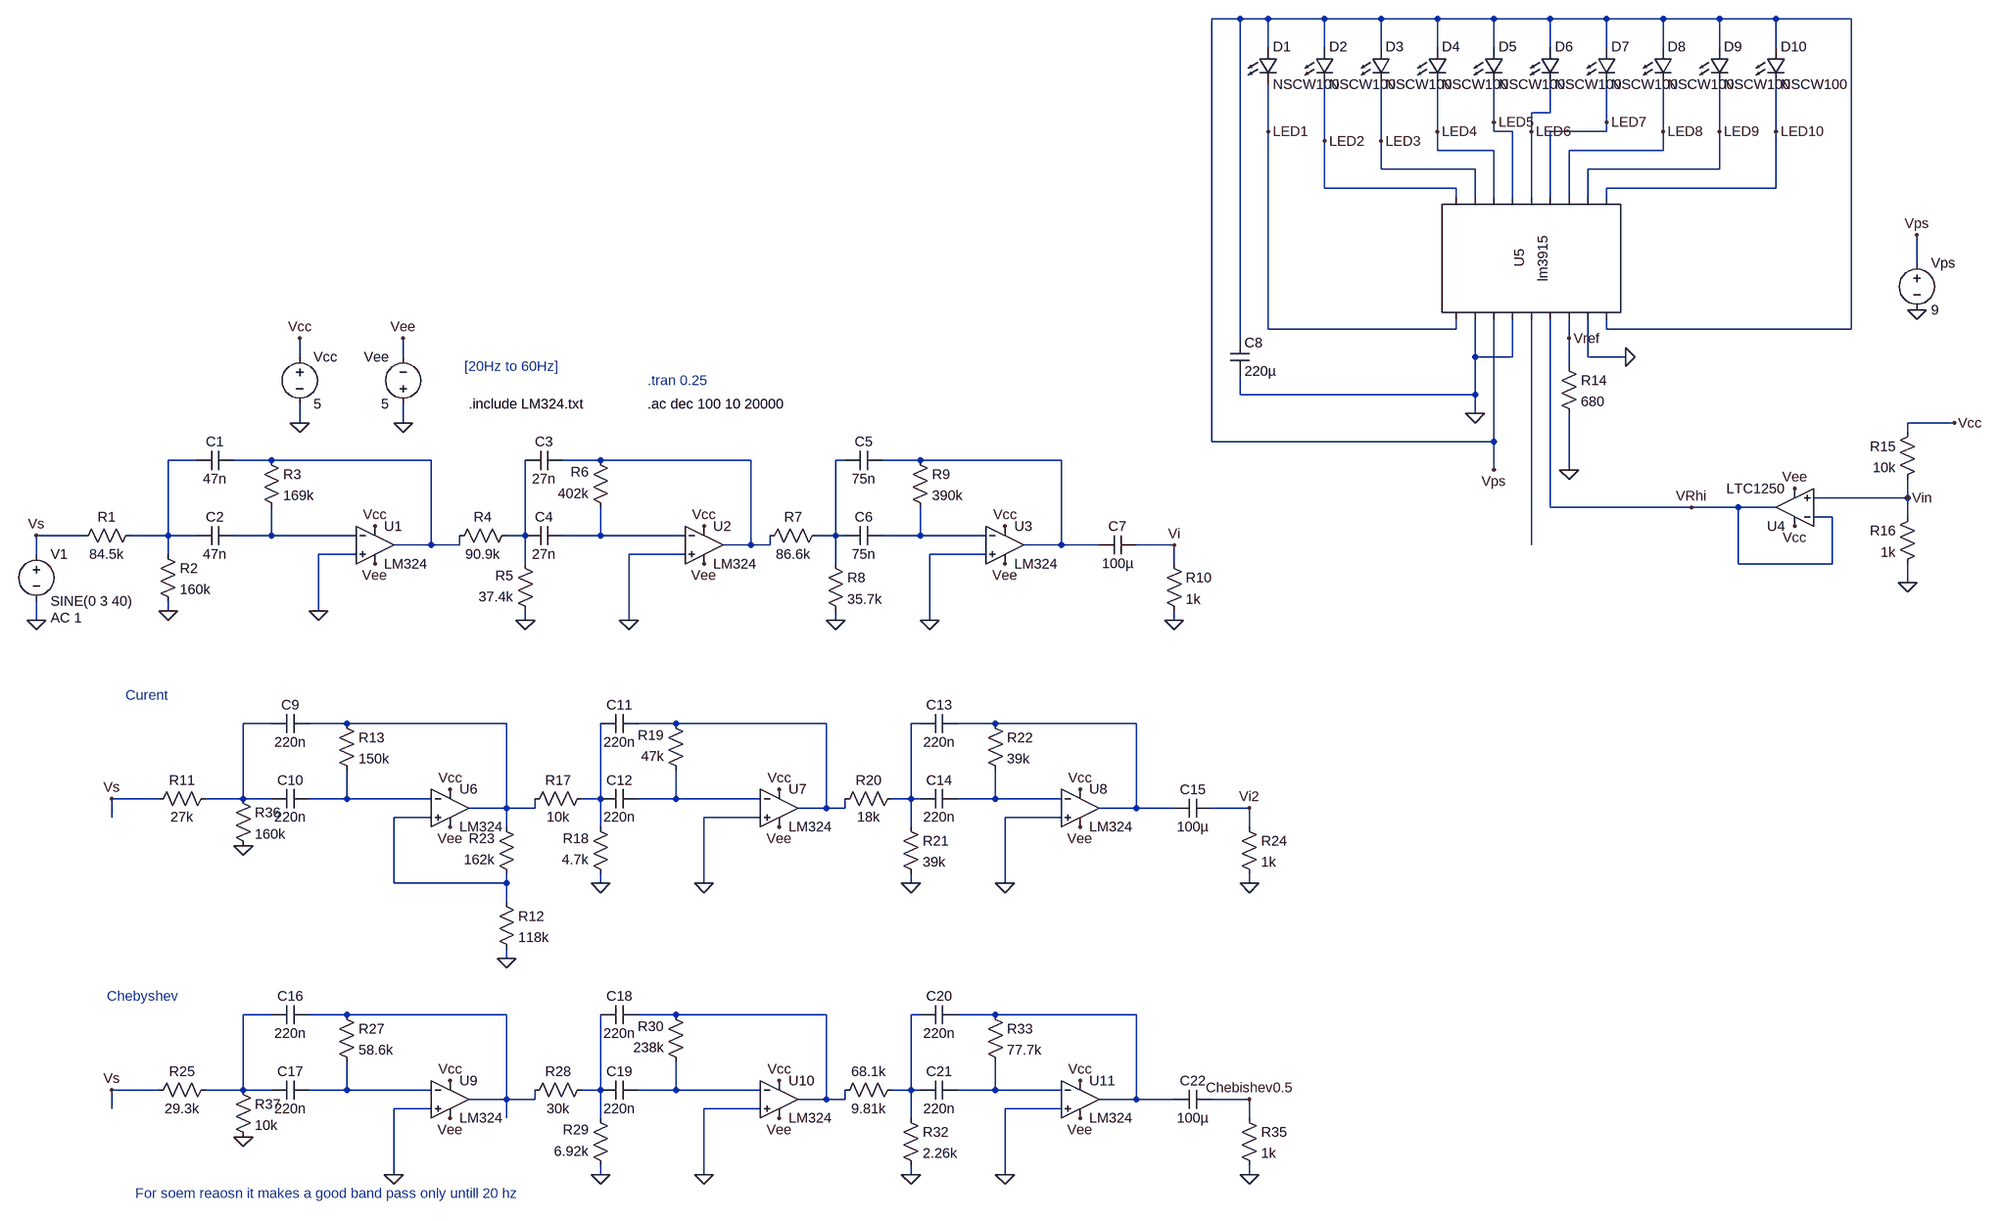
[diagram p0: schematic FinalSubBassFilterWithLEDDriver.asc]
FinalSubBassFilterWithLEDDriver.asc, the LTspice schematic file:
Version 4.1
SHEET 1 5108 1364
WIRE 1568 -736 1520 -736
WIRE 1616 -736 1568 -736
WIRE 1712 -736 1616 -736
WIRE 1808 -736 1712 -736
WIRE 1904 -736 1808 -736
WIRE 2000 -736 1904 -736
WIRE 2096 -736 2000 -736
WIRE 2192 -736 2096 -736
WIRE 2288 -736 2192 -736
WIRE 2384 -736 2288 -736
WIRE 2480 -736 2384 -736
WIRE 2608 -736 2480 -736
WIRE 1616 -688 1616 -736
WIRE 1712 -688 1712 -736
WIRE 1808 -688 1808 -736
WIRE 1904 -688 1904 -736
WIRE 2000 -688 2000 -736
WIRE 2096 -688 2096 -736
WIRE 2192 -688 2192 -736
WIRE 2288 -688 2288 -736
WIRE 2384 -688 2384 -736
WIRE 2480 -688 2480 -736
WIRE 2096 -576 2096 -624
WIRE 2096 -576 2064 -576
WIRE 2000 -560 2000 -624
WIRE 2192 -560 2192 -624
WIRE 1616 -544 1616 -624
WIRE 1904 -544 1904 -624
WIRE 2000 -544 2000 -560
WIRE 2032 -544 2000 -544
WIRE 2064 -544 2064 -576
WIRE 2192 -544 2192 -560
WIRE 2192 -544 2096 -544
WIRE 2288 -544 2288 -624
WIRE 2384 -544 2384 -624
WIRE 2480 -544 2480 -624
WIRE 1712 -528 1712 -624
WIRE 1808 -528 1808 -624
WIRE 1904 -512 1904 -544
WIRE 2000 -512 1904 -512
WIRE 2288 -512 2288 -544
WIRE 2288 -512 2128 -512
WIRE 1808 -480 1808 -528
WIRE 1968 -480 1808 -480
WIRE 2384 -480 2384 -544
WIRE 2384 -480 2160 -480
WIRE 1712 -448 1712 -528
WIRE 1936 -448 1712 -448
WIRE 2480 -448 2480 -544
WIRE 2480 -448 2192 -448
WIRE 1936 -432 1936 -448
WIRE 1968 -432 1968 -480
WIRE 2000 -432 2000 -512
WIRE 2032 -432 2032 -544
WIRE 2064 -432 2064 -544
WIRE 2096 -432 2096 -544
WIRE 2128 -432 2128 -512
WIRE 2160 -432 2160 -480
WIRE 2192 -432 2192 -448
WIRE 2720 -320 2720 -368
WIRE 1616 -208 1616 -544
WIRE 1936 -208 1936 -224
WIRE 1936 -208 1616 -208
WIRE 2192 -208 2192 -224
WIRE 2608 -208 2608 -736
WIRE 2608 -208 2192 -208
WIRE 1568 -192 1568 -736
WIRE 2128 -192 2128 -224
WIRE -32 -160 -32 -192
WIRE 144 -160 144 -192
WIRE 1968 -160 1968 -224
WIRE 2032 -160 2032 -224
WIRE 2032 -160 1968 -160
WIRE 2160 -160 2160 -224
WIRE 2224 -160 2160 -160
WIRE 2128 -144 2128 -192
WIRE 1568 -96 1568 -128
WIRE 1968 -96 1968 -160
WIRE 1968 -96 1568 -96
WIRE 1968 -64 1968 -96
WIRE -32 -48 -32 -80
WIRE 144 -48 144 -80
WIRE 2784 -48 2704 -48
WIRE 2704 -32 2704 -48
WIRE 1520 -16 1520 -736
WIRE 2000 -16 2000 -224
WIRE 2000 -16 1520 -16
WIRE -208 16 -256 16
WIRE -80 16 -144 16
WIRE 192 16 -80 16
WIRE 480 16 416 16
WIRE 736 16 480 16
WIRE 896 16 880 16
WIRE 1024 16 960 16
WIRE 1264 16 1024 16
WIRE 2000 32 2000 -16
WIRE 2128 32 2128 -64
WIRE 2704 80 2704 48
WIRE 2704 80 2544 80
WIRE 2096 96 2096 -224
WIRE 2336 96 2096 96
WIRE 2416 96 2336 96
WIRE 2480 96 2416 96
WIRE 2576 112 2544 112
WIRE 2704 112 2704 80
WIRE -400 144 -480 144
WIRE -256 144 -256 16
WIRE -256 144 -320 144
WIRE -208 144 -256 144
WIRE -80 144 -80 96
WIRE -80 144 -144 144
WIRE 64 144 -80 144
WIRE 352 144 352 16
WIRE 352 144 320 144
WIRE 480 144 480 96
WIRE 480 144 416 144
WIRE 624 144 480 144
WIRE 880 144 880 16
WIRE 880 144 848 144
WIRE 896 144 880 144
WIRE 1024 144 1024 96
WIRE 1024 144 960 144
WIRE 1136 144 1024 144
WIRE 192 160 192 16
WIRE 192 160 128 160
WIRE 240 160 240 144
WIRE 240 160 192 160
WIRE 736 160 736 16
WIRE 736 160 688 160
WIRE 768 160 768 144
WIRE 768 160 736 160
WIRE 1264 160 1264 16
WIRE 1264 160 1200 160
WIRE 1328 160 1264 160
WIRE 1456 160 1392 160
WIRE 2064 160 2064 -224
WIRE -480 176 -480 144
WIRE -256 176 -256 144
WIRE 64 176 0 176
WIRE 624 176 528 176
WIRE 1136 176 1040 176
WIRE 352 192 352 144
WIRE 880 192 880 144
WIRE 1456 192 1456 160
WIRE 2416 192 2416 96
WIRE 2576 192 2576 112
WIRE 2576 192 2416 192
WIRE 2704 224 2704 192
WIRE -256 272 -256 256
WIRE 0 272 0 176
WIRE -480 288 -480 256
WIRE 352 288 352 272
WIRE 528 288 528 176
WIRE 880 288 880 272
WIRE 1040 288 1040 176
WIRE 1456 288 1456 272
WIRE -80 464 -128 464
WIRE 48 464 -16 464
WIRE 320 464 48 464
WIRE 608 464 544 464
WIRE 864 464 608 464
WIRE 1024 464 1008 464
WIRE 1152 464 1088 464
WIRE 1392 464 1152 464
WIRE -272 592 -352 592
WIRE -128 592 -128 464
WIRE -128 592 -192 592
WIRE -80 592 -128 592
WIRE 48 592 48 544
WIRE 48 592 -16 592
WIRE 192 592 48 592
WIRE 480 592 480 464
WIRE 480 592 448 592
WIRE 608 592 608 544
WIRE 608 592 544 592
WIRE 752 592 608 592
WIRE 1008 592 1008 464
WIRE 1008 592 976 592
WIRE 1024 592 1008 592
WIRE 1152 592 1152 544
WIRE 1152 592 1088 592
WIRE 1264 592 1152 592
WIRE 320 608 320 464
WIRE 320 608 256 608
WIRE 368 608 368 592
WIRE 368 608 320 608
WIRE 864 608 864 464
WIRE 864 608 816 608
WIRE 896 608 896 592
WIRE 896 608 864 608
WIRE 1392 608 1392 464
WIRE 1392 608 1328 608
WIRE 1456 608 1392 608
WIRE 1584 608 1520 608
WIRE -352 624 -352 592
WIRE 192 624 128 624
WIRE 752 624 656 624
WIRE 1264 624 1168 624
WIRE 320 640 320 608
WIRE 480 640 480 592
WIRE 1008 640 1008 592
WIRE 1584 640 1584 608
WIRE 128 736 128 624
WIRE 320 736 320 720
WIRE 320 736 128 736
WIRE 480 736 480 720
WIRE 656 736 656 624
WIRE 1008 736 1008 720
WIRE 1168 736 1168 624
WIRE 1584 736 1584 720
WIRE 320 768 320 736
WIRE 320 864 320 848
WIRE -80 960 -128 960
WIRE 48 960 -16 960
WIRE 320 960 48 960
WIRE 608 960 544 960
WIRE 864 960 608 960
WIRE 1024 960 1008 960
WIRE 1152 960 1088 960
WIRE 1392 960 1152 960
WIRE -272 1088 -352 1088
WIRE -128 1088 -128 960
WIRE -128 1088 -192 1088
WIRE -80 1088 -128 1088
WIRE 48 1088 48 1040
WIRE 48 1088 -16 1088
WIRE 192 1088 48 1088
WIRE 480 1088 480 960
WIRE 480 1088 448 1088
WIRE 608 1088 608 1040
WIRE 608 1088 544 1088
WIRE 752 1088 608 1088
WIRE 1008 1088 1008 960
WIRE 1008 1088 976 1088
WIRE 1024 1088 1008 1088
WIRE 1152 1088 1152 1040
WIRE 1152 1088 1088 1088
WIRE 1264 1088 1152 1088
WIRE 320 1104 320 960
WIRE 320 1104 256 1104
WIRE 368 1104 368 1088
WIRE 368 1104 320 1104
WIRE 864 1104 864 960
WIRE 864 1104 816 1104
WIRE 896 1104 896 1088
WIRE 896 1104 864 1104
WIRE 1392 1104 1392 960
WIRE 1392 1104 1328 1104
WIRE 1456 1104 1392 1104
WIRE 1584 1104 1520 1104
WIRE -352 1120 -352 1088
WIRE 192 1120 128 1120
WIRE 752 1120 656 1120
WIRE 1264 1120 1168 1120
WIRE 320 1136 320 1104
WIRE 480 1136 480 1088
WIRE 1008 1136 1008 1088
WIRE 1584 1136 1584 1104
WIRE 128 1232 128 1120
WIRE 480 1232 480 1216
WIRE 656 1232 656 1120
WIRE 1008 1232 1008 1216
WIRE 1168 1232 1168 1120
WIRE 1584 1232 1584 1216
FLAG 528 288 0
FLAG -480 288 0
FLAG -480 144 Vs
FLAG 1040 288 0
FLAG 880 288 0
FLAG 352 288 0
FLAG -256 272 0
FLAG 0 272 0
FLAG 96 192 Vee
FLAG 96 128 Vcc
FLAG 656 192 Vee
FLAG 656 128 Vcc
FLAG 1168 192 Vee
FLAG 1168 128 Vcc
FLAG -32 -192 Vcc
FLAG -32 -48 0
FLAG 144 -48 0
FLAG 144 -192 Vee
FLAG 1456 288 0
FLAG 1456 160 Vi
FLAG 1968 -64 0
FLAG 2720 -240 0
FLAG 2720 -368 Vps
FLAG 2128 32 0
FLAG 2000 32 Vps
FLAG 1616 -544 LED1
FLAG 1712 -528 LED2
FLAG 1808 -528 LED3
FLAG 1904 -544 LED4
FLAG 2000 -560 LED5
FLAG 2064 -544 LED6
FLAG 2192 -560 LED7
FLAG 2288 -544 LED8
FLAG 2384 -544 LED9
FLAG 2480 -544 LED10
FLAG 2224 -160 0
FLAG 2128 -192 Vref
FLAG 2704 224 0
FLAG 2512 128 Vcc
FLAG 2704 80 Vin
FLAG 2336 96 VRhi
FLAG 2512 64 Vee
FLAG 2784 -48 Vcc
FLAG 656 736 0
FLAG -352 592 Vs
FLAG 1168 736 0
FLAG 1008 736 0
FLAG 480 736 0
FLAG 320 864 0
FLAG 224 640 Vee
FLAG 224 576 Vcc
FLAG 784 640 Vee
FLAG 784 576 Vcc
FLAG 1296 640 Vee
FLAG 1296 576 Vcc
FLAG 1584 608 Vi2
FLAG 1584 736 0
FLAG 656 1232 0
FLAG -352 1088 Vs
FLAG 1168 1232 0
FLAG 1008 1232 0
FLAG 480 1232 0
FLAG 224 1136 Vee
FLAG 224 1072 Vcc
FLAG 784 1136 Vee
FLAG 784 1072 Vcc
FLAG 1296 1136 Vee
FLAG 1296 1072 Vcc
FLAG 1584 1104 Chebishev0.5
FLAG 1584 1232 0
FLAG 128 1232 0
FLAG -128 672 0
FLAG -128 1168 0
SYMBOL res -304 128 R90
WINDOW 0 0 56 VBottom 2
WINDOW 3 32 56 VTop 2
SYMATTR InstName R1
SYMATTR Value 84.5k
SYMBOL voltage -480 160 R0
WINDOW 123 24 124 Left 2
WINDOW 39 0 0 Left 0
SYMATTR Value2 AC 1
SYMATTR InstName V1
SYMATTR Value SINE(0 3 40)
SYMBOL res -272 160 R0
SYMATTR InstName R2
SYMATTR Value 160k
SYMBOL res -96 0 R0
SYMATTR InstName R3
SYMATTR Value 169k
SYMBOL res 336 128 R90
WINDOW 0 0 56 VBottom 2
WINDOW 3 32 56 VTop 2
SYMATTR InstName R4
SYMATTR Value 90.9k
SYMBOL res 368 288 R180
WINDOW 0 36 76 Left 2
WINDOW 3 36 40 Left 2
SYMATTR InstName R5
SYMATTR Value 37.4k
SYMBOL res 496 112 R180
WINDOW 0 36 76 Left 2
WINDOW 3 36 40 Left 2
SYMATTR InstName R6
SYMATTR Value 402k
SYMBOL res 752 160 R270
WINDOW 0 32 56 VTop 2
WINDOW 3 0 56 VBottom 2
SYMATTR InstName R7
SYMATTR Value 86.6k
SYMBOL res 864 176 R0
SYMATTR InstName R8
SYMATTR Value 35.7k
SYMBOL res 1008 0 R0
SYMATTR InstName R9
SYMATTR Value 390k
SYMBOL cap -144 0 R90
WINDOW 0 0 32 VBottom 2
WINDOW 3 32 32 VTop 2
SYMATTR InstName C1
SYMATTR Value 47n
SYMBOL cap -144 128 R90
WINDOW 0 0 32 VBottom 2
WINDOW 3 32 32 VTop 2
SYMATTR InstName C2
SYMATTR Value 47n
SYMBOL cap 416 0 R90
WINDOW 0 0 32 VBottom 2
WINDOW 3 32 32 VTop 2
SYMATTR InstName C3
SYMATTR Value 27n
SYMBOL cap 416 128 R90
WINDOW 0 0 32 VBottom 2
WINDOW 3 32 32 VTop 2
SYMATTR InstName C4
SYMATTR Value 27n
SYMBOL cap 960 0 R90
WINDOW 0 0 32 VBottom 2
WINDOW 3 32 32 VTop 2
SYMATTR InstName C5
SYMATTR Value 75n
SYMBOL cap 960 128 R90
WINDOW 0 0 32 VBottom 2
WINDOW 3 32 32 VTop 2
SYMATTR InstName C6
SYMATTR Value 75n
SYMBOL OpAmps\\opamp2 96 96 R0
SYMATTR InstName U1
SYMATTR Value LM324
SYMBOL OpAmps\\opamp2 656 96 R0
SYMATTR InstName U2
SYMATTR Value LM324
SYMBOL OpAmps\\opamp2 1168 96 R0
SYMATTR InstName U3
SYMATTR Value LM324
SYMBOL voltage -32 -176 R0
WINDOW 123 0 0 Left 0
WINDOW 39 0 0 Left 0
SYMATTR InstName Vcc
SYMATTR Value 5
SYMBOL voltage 144 -64 R180
WINDOW 0 24 96 Left 2
WINDOW 3 24 16 Left 2
WINDOW 123 0 0 Left 0
WINDOW 39 0 0 Left 0
SYMATTR InstName Vee
SYMATTR Value 5
SYMBOL cap 1392 144 R90
WINDOW 0 0 32 VBottom 2
WINDOW 3 32 32 VTop 2
SYMATTR InstName C7
SYMATTR Value 100µ
SYMBOL res 1440 176 R0
SYMATTR InstName R10
SYMATTR Value 1k
SYMBOL LED 1600 -688 R0
SYMATTR InstName D1
SYMATTR Value NSCW100
SYMBOL LED 1696 -688 R0
SYMATTR InstName D2
SYMATTR Value NSCW100
SYMBOL LED 1792 -688 R0
SYMATTR InstName D3
SYMATTR Value NSCW100
SYMBOL LED 1888 -688 R0
SYMATTR InstName D4
SYMATTR Value NSCW100
SYMBOL LED 1984 -688 R0
SYMATTR InstName D5
SYMATTR Value NSCW100
SYMBOL LED 2080 -688 R0
SYMATTR InstName D6
SYMATTR Value NSCW100
SYMBOL LED 2176 -688 R0
SYMATTR InstName D7
SYMATTR Value NSCW100
SYMBOL LED 2272 -688 R0
SYMATTR InstName D8
SYMATTR Value NSCW100
SYMBOL LED 2368 -688 R0
SYMATTR InstName D9
SYMATTR Value NSCW100
SYMBOL LED 2464 -688 R0
SYMATTR InstName D10
SYMATTR Value NSCW100
SYMBOL cap 1552 -192 R0
SYMATTR InstName C8
SYMATTR Value 220µ
SYMBOL voltage 2720 -336 R0
WINDOW 123 0 0 Left 0
WINDOW 39 0 0 Left 0
SYMATTR InstName Vps
SYMATTR Value 9
SYMBOL AutoGenerated\\lm3915 2064 -320 R270
SYMATTR InstName U5
SYMBOL res 2112 -160 R0
SYMATTR InstName R14
SYMATTR Value 680
SYMBOL res 2720 -48 M0
SYMATTR InstName R15
SYMATTR Value 10k
SYMBOL res 2720 96 M0
SYMATTR InstName R16
SYMATTR Value 1k
SYMBOL OpAmps\\LTC1250 2512 160 R180
SYMATTR InstName U4
SYMBOL res -176 576 R90
WINDOW 0 0 56 VBottom 2
WINDOW 3 32 56 VTop 2
SYMATTR InstName R11
SYMATTR Value 27k
SYMBOL res 304 752 R0
SYMATTR InstName R12
SYMATTR Value 118k
SYMBOL res 32 448 R0
SYMATTR InstName R13
SYMATTR Value 150k
SYMBOL res 464 576 R90
WINDOW 0 0 56 VBottom 2
WINDOW 3 32 56 VTop 2
SYMATTR InstName R17
SYMATTR Value 10k
SYMBOL res 496 736 R180
WINDOW 0 36 76 Left 2
WINDOW 3 36 40 Left 2
SYMATTR InstName R18
SYMATTR Value 4.7k
SYMBOL res 624 560 R180
WINDOW 0 36 76 Left 2
WINDOW 3 36 40 Left 2
SYMATTR InstName R19
SYMATTR Value 47k
SYMBOL res 880 608 R270
WINDOW 0 32 56 VTop 2
WINDOW 3 0 56 VBottom 2
SYMATTR InstName R20
SYMATTR Value 18k
SYMBOL res 992 624 R0
SYMATTR InstName R21
SYMATTR Value 39k
SYMBOL res 1136 448 R0
SYMATTR InstName R22
SYMATTR Value 39k
SYMBOL cap -16 448 R90
WINDOW 0 0 32 VBottom 2
WINDOW 3 32 32 VTop 2
SYMATTR InstName C9
SYMATTR Value 220n
SYMBOL cap -16 576 R90
WINDOW 0 0 32 VBottom 2
WINDOW 3 32 32 VTop 2
SYMATTR InstName C10
SYMATTR Value 220n
SYMBOL cap 544 448 R90
WINDOW 0 0 32 VBottom 2
WINDOW 3 32 32 VTop 2
SYMATTR InstName C11
SYMATTR Value 220n
SYMBOL cap 544 576 R90
WINDOW 0 0 32 VBottom 2
WINDOW 3 32 32 VTop 2
SYMATTR InstName C12
SYMATTR Value 220n
SYMBOL cap 1088 448 R90
WINDOW 0 0 32 VBottom 2
WINDOW 3 32 32 VTop 2
SYMATTR InstName C13
SYMATTR Value 220n
SYMBOL cap 1088 576 R90
WINDOW 0 0 32 VBottom 2
WINDOW 3 32 32 VTop 2
SYMATTR InstName C14
SYMATTR Value 220n
SYMBOL res 336 736 R180
WINDOW 0 36 76 Left 2
WINDOW 3 36 40 Left 2
SYMATTR InstName R23
SYMATTR Value 162k
SYMBOL OpAmps\\opamp2 224 544 R0
SYMATTR InstName U6
SYMATTR Value LM324
SYMBOL OpAmps\\opamp2 784 544 R0
SYMATTR InstName U7
SYMATTR Value LM324
SYMBOL OpAmps\\opamp2 1296 544 R0
SYMATTR InstName U8
SYMATTR Value LM324
SYMBOL cap 1520 592 R90
WINDOW 0 0 32 VBottom 2
WINDOW 3 32 32 VTop 2
SYMATTR InstName C15
SYMATTR Value 100µ
SYMBOL res 1568 624 R0
SYMATTR InstName R24
SYMATTR Value 1k
SYMBOL res -176 1072 R90
WINDOW 0 0 56 VBottom 2
WINDOW 3 32 56 VTop 2
SYMATTR InstName R25
SYMATTR Value 29.3k
SYMBOL res 32 944 R0
SYMATTR InstName R27
SYMATTR Value 58.6k
SYMBOL res 464 1072 R90
WINDOW 0 0 56 VBottom 2
WINDOW 3 32 56 VTop 2
SYMATTR InstName R28
SYMATTR Value 30k
SYMBOL res 496 1232 R180
WINDOW 0 36 76 Left 2
WINDOW 3 36 40 Left 2
SYMATTR InstName R29
SYMATTR Value 6.92k
SYMBOL res 624 1056 R180
WINDOW 0 36 76 Left 2
WINDOW 3 36 40 Left 2
SYMATTR InstName R30
SYMATTR Value 238k
SYMBOL res 880 1104 R270
WINDOW 0 32 56 VTop 2
WINDOW 3 0 56 VBottom 2
SYMATTR InstName 68.1k
SYMATTR Value 9.81k
SYMBOL res 992 1120 R0
SYMATTR InstName R32
SYMATTR Value 2.26k
SYMBOL res 1136 944 R0
SYMATTR InstName R33
SYMATTR Value 77.7k
SYMBOL cap -16 944 R90
WINDOW 0 0 32 VBottom 2
WINDOW 3 32 32 VTop 2
SYMATTR InstName C16
SYMATTR Value 220n
SYMBOL cap -16 1072 R90
WINDOW 0 0 32 VBottom 2
WINDOW 3 32 32 VTop 2
SYMATTR InstName C17
SYMATTR Value 220n
SYMBOL cap 544 944 R90
WINDOW 0 0 32 VBottom 2
WINDOW 3 32 32 VTop 2
SYMATTR InstName C18
SYMATTR Value 220n
SYMBOL cap 544 1072 R90
WINDOW 0 0 32 VBottom 2
WINDOW 3 32 32 VTop 2
SYMATTR InstName C19
SYMATTR Value 220n
SYMBOL cap 1088 944 R90
WINDOW 0 0 32 VBottom 2
WINDOW 3 32 32 VTop 2
SYMATTR InstName C20
SYMATTR Value 220n
SYMBOL cap 1088 1072 R90
WINDOW 0 0 32 VBottom 2
WINDOW 3 32 32 VTop 2
SYMATTR InstName C21
SYMATTR Value 220n
SYMBOL OpAmps\\opamp2 224 1040 R0
SYMATTR InstName U9
SYMATTR Value LM324
SYMBOL OpAmps\\opamp2 784 1040 R0
SYMATTR InstName U10
SYMATTR Value LM324
SYMBOL OpAmps\\opamp2 1296 1040 R0
SYMATTR InstName U11
SYMATTR Value LM324
SYMBOL cap 1520 1088 R90
WINDOW 0 0 32 VBottom 2
WINDOW 3 32 32 VTop 2
SYMATTR InstName C22
SYMATTR Value 100µ
SYMBOL res 1568 1120 R0
SYMATTR InstName R35
SYMATTR Value 1k
SYMBOL res -144 576 R0
SYMATTR InstName R36
SYMATTR Value 160k
SYMBOL res -144 1072 R0
SYMATTR InstName R37
SYMATTR Value 10k
TEXT 560 -120 Left 2 ;.tran 0.25
TEXT 560 -80 Left 2 !.ac dec 100 10 20000
TEXT 248 -144 Left 2 ;[20Hz to 60Hz]
TEXT 256 -80 Left 2 !.include LM324.txt
TEXT -328 416 Left 2 ;Curent
TEXT -360 928 Left 2 ;Chebyshev
TEXT -312 1264 Left 2 ;For soem reaosn it makes a good band pass only untill 20 hz

The netlist it stands for:
* FinalSubBassFilterWithLEDDriver.asc
R1 N001 Vs 84.5k
V1 Vs 0 SINE(0 3 40) AC 1
R2 N001 0 160k
R3 N002 N006 169k
R4 N007 N002 90.9k
R5 0 N007 37.4k
R6 N008 N003 402k
R7 N003 N004 86.6k
R8 N004 0 35.7k
R9 N005 N009 390k
C1 N002 N001 47n
C2 N006 N001 47n
C3 N003 N007 27n
C4 N008 N007 27n
C5 N005 N004 75n
C6 N009 N004 75n
X§U1 0 N006 Vcc Vee N002 LM324  ; pins In+ In- V+ V- OUT
X§U2 0 N008 Vcc Vee N003 LM324  ; pins In+ In- V+ V- OUT
X§U3 0 N009 Vcc Vee N005 LM324  ; pins In+ In- V+ V- OUT
Vcc Vcc 0 5
Vee 0 Vee 5
C7 Vi N005 100µ
R10 Vi 0 1k
D1 Vps LED1 NSCW100
D2 Vps LED2 NSCW100
D3 Vps LED3 NSCW100
D4 Vps LED4 NSCW100
D5 Vps LED5 NSCW100
D6 Vps LED6 NSCW100
D7 Vps LED7 NSCW100
D8 Vps LED8 NSCW100
D9 Vps LED9 NSCW100
D10 Vps LED10 NSCW100
C8 Vps 0 220µ
Vps Vps 0 9
* U5: lm3915 (symbol AutoGenerated\lm3915 not available, pins judged from their places): pin1=LED1 pin2=0 pin3=Vps pin4=0 pin5=N010 pin6=VRhi pin7=Vref pin8=0 pin9=Vps pin10=LED2 pin11=LED3 pin12=LED4 pin13=LED5 pin14=LED6 pin15=LED7 pin16=LED8 pin17=LED9 pin18=LED10
R14 Vref 0 680
R15 Vcc Vin 10k
R16 Vin 0 1k
X§U4 Vin VRhi Vcc Vee VRhi LTC1250  ; pins In+ In- V+ V- OUT
R11 N011 Vs 27k
R12 N020 0 118k
R13 N012 N016 150k
R17 N017 N012 10k
R18 0 N017 4.7k
R19 N018 N013 47k
R20 N013 N014 18k
R21 N014 0 39k
R22 N015 N019 39k
C9 N012 N011 220n
C10 N016 N011 220n
C11 N013 N017 220n
C12 N018 N017 220n
C13 N015 N014 220n
C14 N019 N014 220n
R23 N020 N012 162k
X§U6 N020 N016 Vcc Vee N012 LM324  ; pins In+ In- V+ V- OUT
X§U7 0 N018 Vcc Vee N013 LM324  ; pins In+ In- V+ V- OUT
X§U8 0 N019 Vcc Vee N015 LM324  ; pins In+ In- V+ V- OUT
C15 Vi2 N015 100µ
R24 Vi2 0 1k
R25 N021 Vs 29.3k
R27 N022 N026 58.6k
R28 N027 N022 30k
R29 0 N027 6.92k
R30 N028 N023 238k
R§68.1k N023 N024 9.81k
R32 N024 0 2.26k
R33 N025 N029 77.7k
C16 N022 N021 220n
C17 N026 N021 220n
C18 N023 N027 220n
C19 N028 N027 220n
C20 N025 N024 220n
C21 N029 N024 220n
X§U9 0 N026 Vcc Vee N022 LM324  ; pins In+ In- V+ V- OUT
X§U10 0 N028 Vcc Vee N023 LM324  ; pins In+ In- V+ V- OUT
X§U11 0 N029 Vcc Vee N025 LM324  ; pins In+ In- V+ V- OUT
C22 Chebishev0.5 N025 100µ
R35 Chebishev0.5 0 1k
R36 N011 0 160k
R37 N021 0 10k
.model D D
.lib standard.dio
* .tran 0.25
.ac dec 100 10 20000
* [20Hz to 60Hz]
.include LM324.txt
* Curent
* Chebyshev
* For soem reaosn it makes a good band pass only untill 20 hz
.backanno
.end